# Altium project eHub.PrjPcb
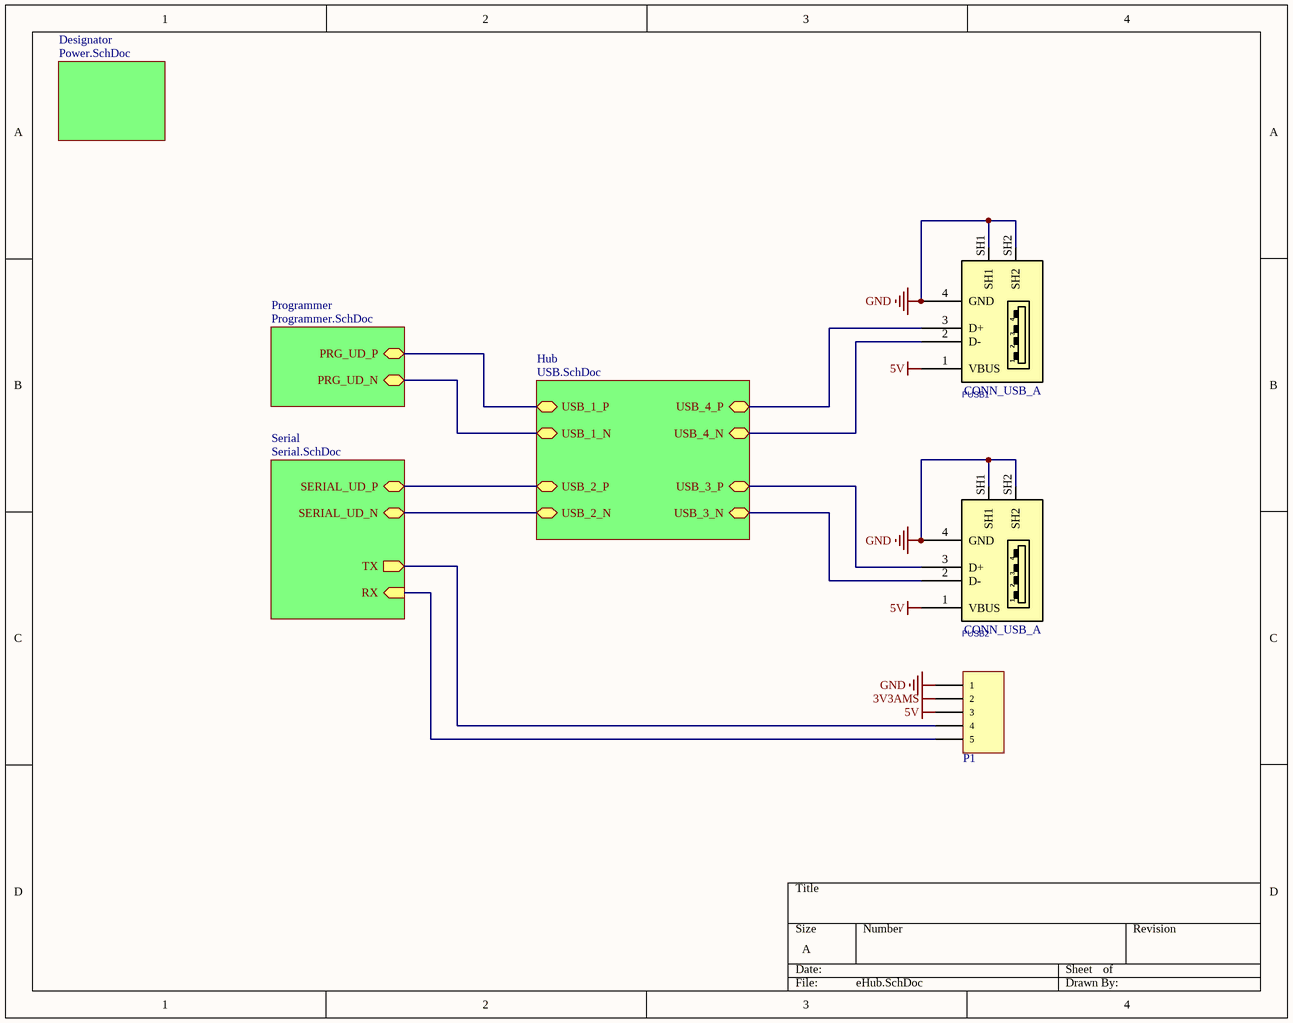
[diagram p0: eHub.SchDoc]
5 sheets, 86 parts. Net scope: hierarchical (ports join the sheet entries above them; power ports are global).
Board file: eHub.PcbDoc
Sheets:
  eHub.SchDoc
    Programmer = Programmer.SchDoc
    Serial = Serial.SchDoc
    Hub = USB.SchDoc
    Designator = Power.SchDoc

## Sheet eHub.SchDoc
size A; SheetNumber: 1; SheetTotal: 5

### Parts
P1  Header, 5-Pin  [HDR1X5]  (value not drawn)
PUSB1  CONN_USB_A  [USB_A_REC_RA_THD]
PUSB2  CONN_USB_A  [USB_A_REC_RA_THD]

### Sub-sheets
Designator = Power.SchDoc: no entries
Hub = USB.SchDoc: USB_4_P (bidir), USB_3_N (bidir), USB_2_P (bidir), USB_1_P (bidir), USB_3_P (bidir), USB_4_N (bidir), USB_2_N (bidir), USB_1_N (bidir)
Programmer = Programmer.SchDoc: PRG_UD_N (bidir), PRG_UD_P (bidir)
Serial = Serial.SchDoc: SERIAL_UD_N (bidir), TX (out), RX (in), SERIAL_UD_P (bidir)

### Nets
3V3AMS: P1.2
5V: P1.3 PUSB1.1(VBUS) PUSB2.1(VBUS)
GND: P1.1 PUSB1.4(GND) PUSB1.SH1 PUSB1.SH2 PUSB2.4(GND) PUSB2.SH1 PUSB2.SH2
PRG_UD_N: sheet Programmer/PRG_UD_N, sheet Hub/USB_1_N
PRG_UD_P: sheet Programmer/PRG_UD_P, sheet Hub/USB_1_P
RX: P1.5 ; sheet Serial/RX
SERIAL_UD_N: sheet Serial/SERIAL_UD_N, sheet Hub/USB_2_N
SERIAL_UD_P: sheet Serial/SERIAL_UD_P, sheet Hub/USB_2_P
TX: P1.4 ; sheet Serial/TX
USB_3_N: PUSB2.2(D-) ; sheet Hub/USB_3_N
USB_3_P: PUSB2.3(D+) ; sheet Hub/USB_3_P
USB_4_N: PUSB1.2(D-) ; sheet Hub/USB_4_N
USB_4_P: PUSB1.3(D+) ; sheet Hub/USB_4_P

### Library data of the parts
P1 = Header 5: LatestRevisionDate: 17-Jul-2002; LatestRevisionNote: Re-released for DXP Platform.; Publisher: Altium Limited
PUSB1 PUSB2 = CONN_USB_A_REC_RA_THD: CONN, USB, A, RECEPTACLE, R/A, THD; VALUE: CONN_USB_A

## Sheet Programmer.SchDoc
size A4; SheetNumber: 4; SheetTotal: 5
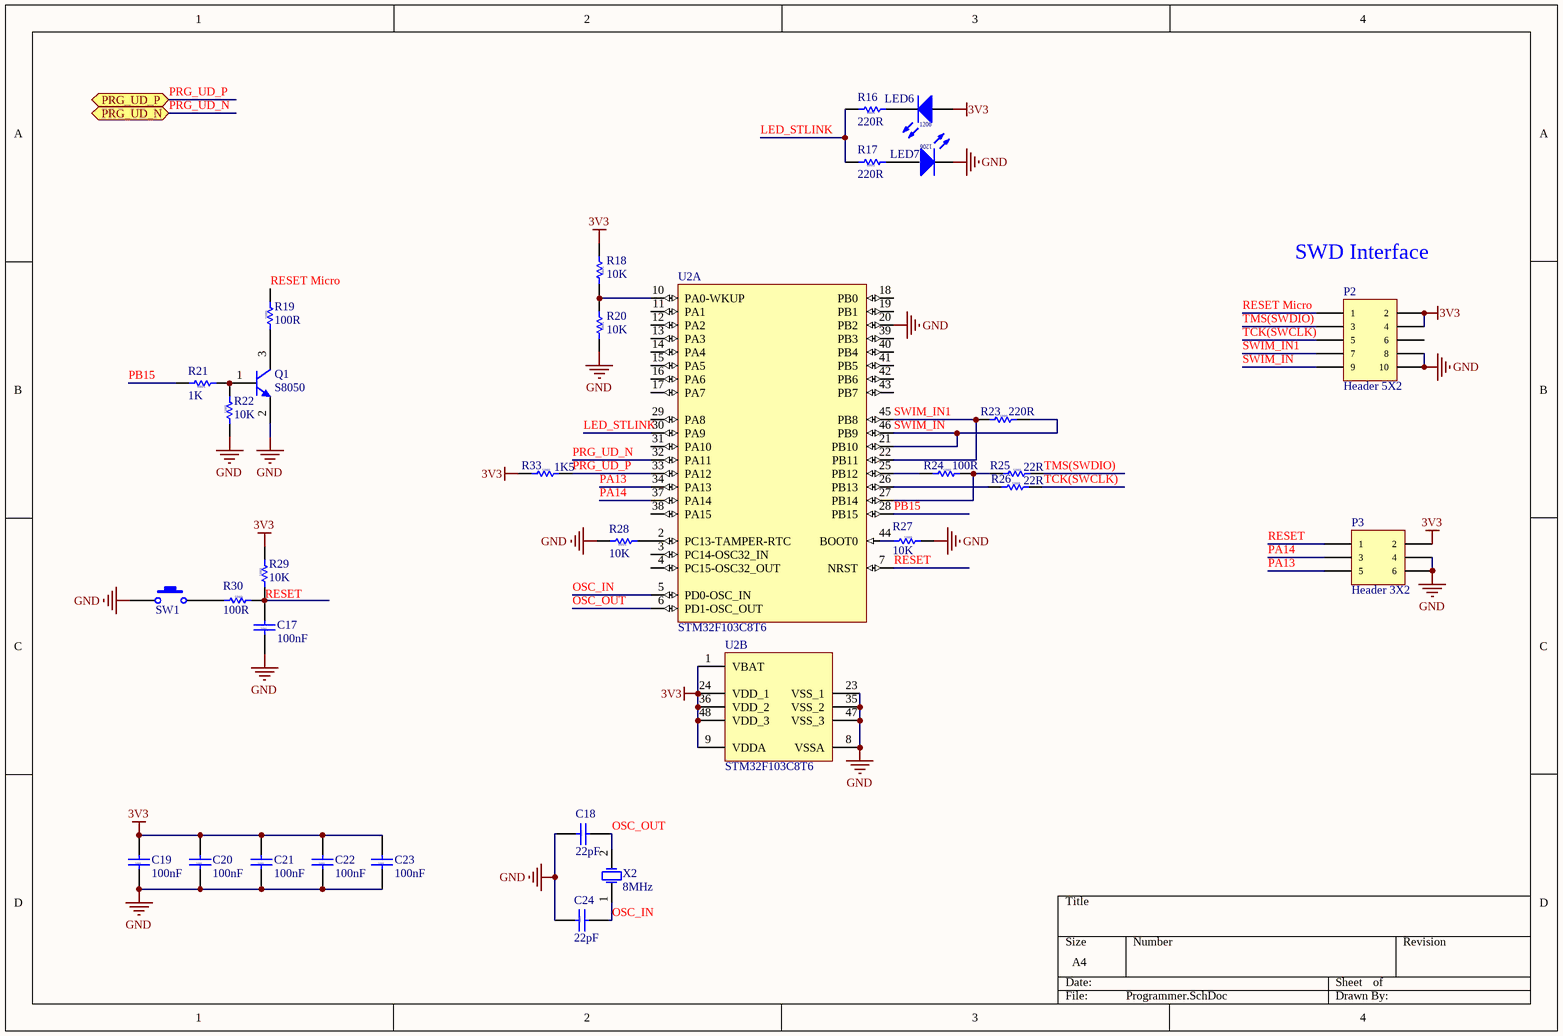
[diagram p1: Programmer.SchDoc]

### Parts
C17  100nF  [RES 0805]
C18  22pF  [RES 0805]
C19  100nF  [RES 0805]
C20  100nF  [RES 0805]
C21  100nF  [RES 0805]
C22  100nF  [RES 0805]
C23  100nF  [RES 0805]
C24  22pF  [RES 0805]
LED6  LED 1206  [LED 1206]  (value not drawn)
LED7  LED 1206  [LED 1206]  (value not drawn)
P2  Header 5X2  [HDR2X5]
P3  Header 3X2  [HDR2X3]
Q1  S8050  [SOT-23]
R16  220R  [RES 0805]
R17  220R  [RES 0805]
R18  10K  [RES 0805]
R19  100R  [RES 0805]
R20  10K  [RES 0805]
R21  1K  [RES 0805]
R22  10K  [RES 0805]
R23  220R  [RES 0805]
R24  100R  [RES 0805]
R25  22R  [RES 0805]
R26  22R  [RES 0805]
R27  10K  [RES 0805]
R28  10K  [RES 0805]
R29  10K  [RES 0805]
R30  100R  [RES 0805]
R33  1K5  [RES 0805]
SW1  Pushing Switch  [micro sch]  (value not drawn)
U2  STM32F103C8T6  [STM-LQFP48_N]  (parts A,B of 2)
X2  8MHz  [XTAL - SMD]

### Ports
PRG_UD_N (bidir), PRG_UD_P (bidir)

### Nets
3V3: C19.2 C20.2 C21.2 C22.2 C23.2 LED6.1(A) P2.2 P2.4 P3.2 R18.1 R29.2 R33.1 U2.1(VBAT) U2.9(VDDA) U2.24(VDD_1) U2.36(VDD_2) U2.48(VDD_3)
GND: C17.1 C18.1 C19.1 C20.1 C21.1 C22.1 C23.1 C24.1 LED7.2(K) P2.8 P2.10 P3.4 P3.6 Q1.2(E) R20.2 R22.1 R27.2 R28.2 SW1.1 U2.8(VSSA) U2.20(PB2) U2.23(VSS_1) U2.35(VSS_2) U2.47(VSS_3)
LED_STLINK: R16.2 R17.2 U2.30(PA9)
OSC_IN: C24.2 U2.5(PD0-OSC_IN) X2.1(OSC1)
OSC_OUT: C18.2 U2.6(PD1-OSC_OUT) X2.2(OSC2)
PA13: P3.5 U2.34(PA13)
PA14: P3.3 U2.37(PA14)
PB15: R21.2 U2.28(PB15)
PRG_UD_N: U2.32(PA11) ; port PRG_UD_N
PRG_UD_P: R33.2 U2.33(PA12) ; port PRG_UD_P
RESET: C17.2 P3.1 R29.1 R30.2 U2.7(NRST)
RESET Micro: P2.1 R19.2
SWIM_IN: P2.9 R23.2 U2.21(PB10) U2.46(PB9)
SWIM_IN1: P2.7 R23.1 U2.22(PB11) U2.45(PB8)
TCK(SWCLK): P2.5 R26.2
TMS(SWDIO): P2.3 R25.2
NetLED6_2: LED6.2(K) R16.1
NetLED7_1: LED7.1(A) R17.1
NetQ1_1: Q1.1(B) R21.1 R22.2
NetQ1_3: Q1.3(C) R19.1
NetR18_2: R18.2 R20.1 U2.10(PA0-WKUP)
NetR24_1: R24.1 U2.25(PB12)
NetR24_2: R24.2 R25.1 U2.27(PB14)
NetR26_1: R26.1 U2.26(PB13)
NetR27_1: R27.1 U2.44(BOOT0)
NetR28_1: R28.1 U2.2(PC13-TAMPER-RTC)
NetR30_1: R30.1 SW1.2

Not connected (* = marked no-connect by the designer): P2 6; U2 3(PC14-OSC32_IN) 4(PC15-OSC32_OUT) 11(PA1) 12(PA2) 13(PA3) 14(PA4) 15(PA5) 16(PA6) 17(PA7) 18(PB0) 19(PB1) 29(PA8) 31(PA10) 38(PA15) 39(PB3) 40(PB4) 41(PB5) 42(PB6) 43(PB7)

### Notes on the sheet
- (near P2) SWD Interface
- (in symbol CAP 0805) 0805
- (in symbol LED 1206) 1206
- (in symbol RES 0805) 0805

### Library data of the parts
C17-C24 = CAP 0805
P2 = Header 5X2: Header, 5-Pin, Dual row; LatestRevisionDate: 17-Jul-2002; LatestRevisionNote: Re-released for DXP Platform.; Publisher: Altium Limited
P3 = Header 3X2: Header, 3-Pin, Dual row; LatestRevisionDate: 17-Jul-2002; LatestRevisionNote: Re-released for DXP Platform.; Publisher: Altium Limited
Q1 = S8050 SMD
R16-R30 R33 = RES 0805
SW1 = Pushing Switch 2Pin: Published: 24-Mar-1999; LatestRevisionDate: 17-Jul-2002; LatestRevisionNote: Re-released for DXP Platform.; PackageReference: SPST-2; Publisher: Altium Limited
U2 = STM32F103C8T6: ARM Cortex-M3 32-bit MCU, 64 KB Flash, 20 KB Internal RAM, 37 I/Os, 48-pin LQFP, -40 to 85 degC, Tray; A/D Converter: 2x12-bit (10 Channel); FLASH Size (Prog) (kB): 64; I/Os (High Current): 37; Internal RAM Size (kB): 20; Operating Frequency(F) (Processor speed) (MHz): 72; Supply Voltage(Vcc) min (V): 2; DatasheetVersion: Rev. 16; PackageVersion: Rev. 6, 06/2013; PackageReference: LQFP48; PackageDescription: 48-Pin Low Profile Quad Flat Package, 7 x 7 mm Body, 0.5 mm Pitch; Supplier 1: Digi-Key; Supplier Part Number 1: 497-6063-ND; Supplier 2: Farnell; Supplier Part Number 2: 1447637; Supplier 3: Newark; Supplier Part Number 3: 59M2182; Supplier 4: Newark; Supplier Part Number 4: 57P1222; Supplier 5: Mouser; Supplier Part Number 5: 511-STM32F103C8T6; Core: ARM Cortex-M3; Packing: Tray; Mounting Technology: Surface Mount; PartNumber: STM32F103C8T6; ComponentLink1Description: Manufacturer URL; ComponentLink1URL: http://www.st.com/web/en/home.html; ComponentLink2Description: Datasheet; ComponentLink2URL: http://www.st.com/st-web-ui/static/active/en/resource/technical/document/datasheet/CD00161566.pdf; ComponentLink3Description: Package Specification; ComponentLink3URL: http://www.st.com/st-web-ui/static/active/en/resource/technical/document/datasheet/DM00058181.pdf
X2 = XTAL - SMD

## Sheet Serial.SchDoc
size A; SheetNumber: 4; SheetTotal: 5
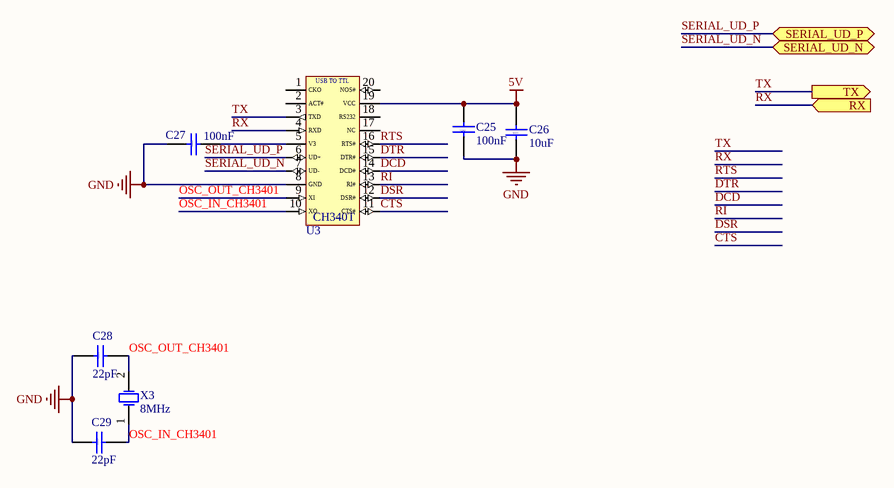
[diagram p2: Serial.SchDoc]

### Parts
C25  100nF  [RES 0805]
C26  10uF  [Res 1206]
C27  100nF  [RES 0805]
C28  22pF  [RES 0805]
C29  22pF  [RES 0805]
U3  CH340  [SSOP20]  (value not drawn)
X3  8MHz  [XTAL - SMD]

### Ports
RX (in), SERIAL_UD_N (bidir), SERIAL_UD_P (bidir), TX (out)

### Nets
5V: C25.2 C26.2 U3.19(VCC)
GND: C25.1 C26.1 C27.1 C28.1 C29.1 U3.8(GND)
CTS: U3.11(CTS#)
DCD: U3.14(DCD#)
DSR: U3.12(DSR#)
DTR: U3.15(DTR#)
OSC_IN_CH3401: C29.2 U3.10(XO) X3.1(OSC1)
OSC_OUT_CH3401: C28.2 U3.9(XI) X3.2(OSC2)
RI: U3.13(RI#)
RTS: U3.16(RTS#)
RX: U3.4(RXD) ; port RX
SERIAL_UD_N: U3.7(UD-) ; port SERIAL_UD_N
SERIAL_UD_P: U3.6(UD+) ; port SERIAL_UD_P
TX: U3.3(TXD) ; port TX
NetC27_2: C27.2 U3.5(V3)

Not connected (* = marked no-connect by the designer): U3 1(CKO) 2(ACT#) 17(NC) 18(RS232) 20(NOS#)

### Notes on the sheet
- (in symbol CAP 0805) 0805
- (in symbol CAP 1206) 1206
- (in symbol CH340T) USB TO TTL

### Library data of the parts
C25 C27-C29 = CAP 0805
C26 = CAP 1206
U3 = CH340T: USB to serial chip CH340
X3 = XTAL - SMD

## Sheet USB.SchDoc
size A; SheetNumber: 3; SheetTotal: 5
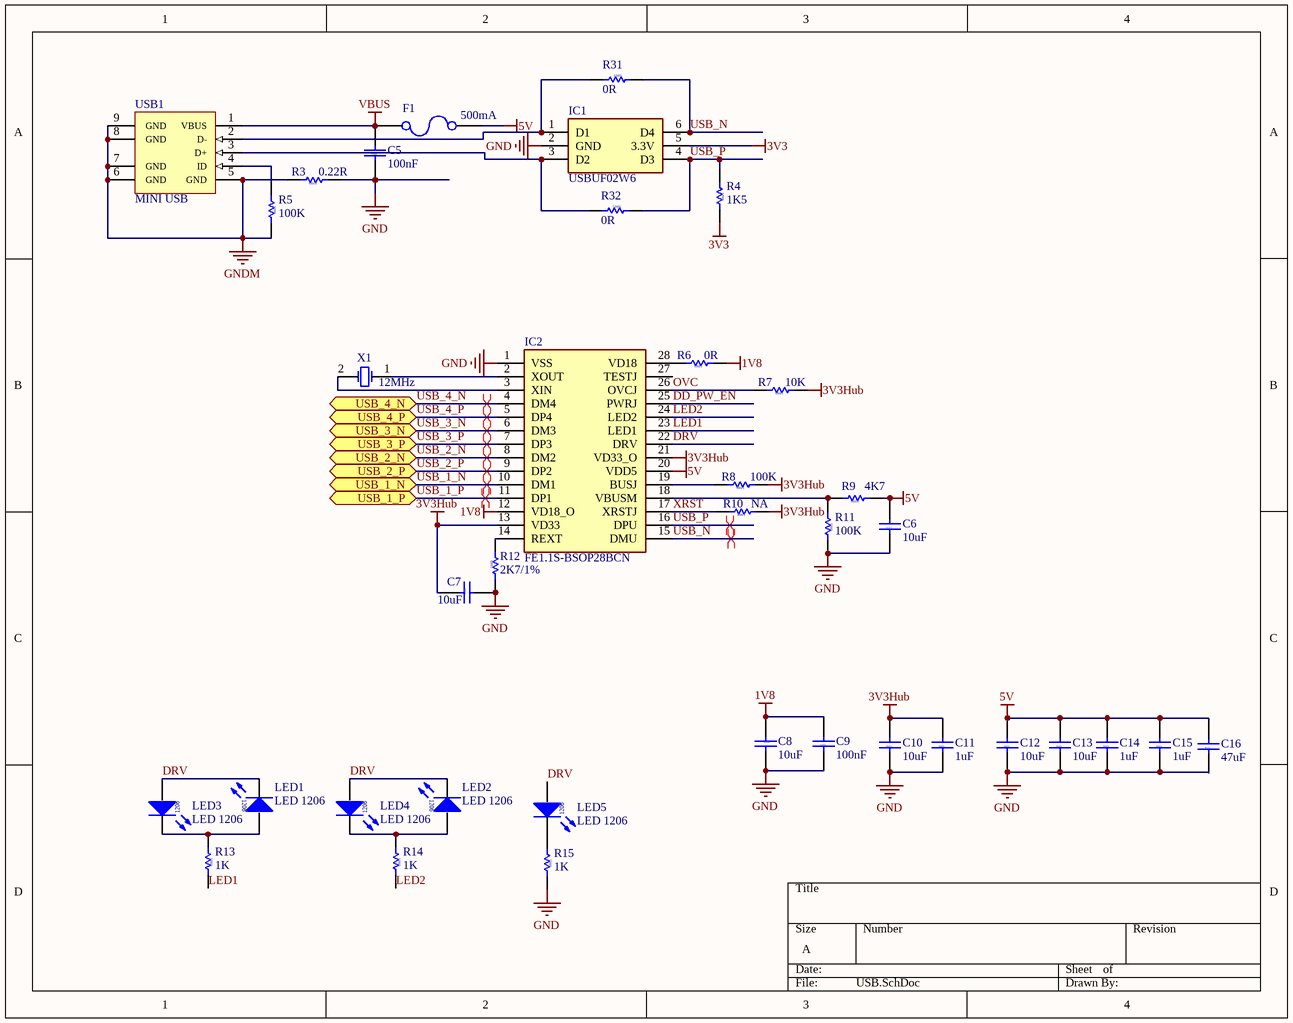
[diagram p3: USB.SchDoc]

### Parts
C5  100nF  [RES 0805]
C6  10uF  [Res 1206]
C7  10uF  [Res 1206]
C8  10uF  [Res 1206]
C9  100nF  [RES 0805]
C10  10uF  [Res 1206]
C11  1uF  [Res 1206]
C12  10uF  [Res 1206]
C13  10uF  [Res 1206]
C14  1uF  [Res 1206]
C15  1uF  [Res 1206]
C16  47uF  [Res 1206]
F1  500mA  [Res 1206]
IC1  USBUF02W6  [SOT65P210X110-6N]
IC2  FE1.1S-BSOP28BCN  [SOP64P600X175-28N]
LED1  LED 1206  [LED 1206]
LED2  LED 1206  [LED 1206]
LED3  LED 1206  [LED 1206]
LED4  LED 1206  [LED 1206]
LED5  LED 1206  [LED 1206]
R3  0.22R  [RES 0805]
R4  1K5  [RES 0805]
R5  100K  [RES 0805]
R6  0R  [RES 0805]
R7  10K  [RES 0805]
R8  100K  [RES 0805]
R9  4K7  [RES 0805]
R10  NA  [RES 0805]
R11  100K  [RES 0805]
R12  2K7/1%  [RES 0805]
R13  1K  [RES 0805]
R14  1K  [RES 0805]
R15  1K  [RES 0805]
R31  0R  [RES 0805]
R32  0R  [RES 0805]
USB1  MINI USB  [USB MINI DIP]
X1  12MHz  [XTAL - SMD]

### Ports
USB_1_N (bidir), USB_1_P (bidir), USB_2_N (bidir), USB_2_P (bidir), USB_3_N (bidir), USB_3_P (bidir), USB_4_N (bidir), USB_4_P (bidir)

### Nets
1V8: C8.1 C9.2 IC2.12(VD18_O) R6.1
3V3: IC1.5(3.3V) R4.2
3V3Hub: C7.1 C10.2 C11.2 IC2.13(VD33) IC2.21(VD33_O) R7.1 R8.1 R10.1
5V: C6.2 C12.2 C13.2 C14.2 C15.2 C16.2 F1.2 IC2.20(VDD5) R9.1
GND: C5.1 C6.1 C7.2 C8.2 C9.1 C10.1 C11.1 C12.1 C13.1 C14.1 C15.1 C16.1 IC1.2(GND) IC2.1(VSS) R3.1 R11.2 R12.1 R15.2
GNDM: R3.2 R5.2 USB1.5(GND) USB1.6(GND) USB1.7(GND) USB1.8(GND) USB1.9(GND)
VBUS: C5.2 F1.1 USB1.1(VBUS)
DD_PW_EN: IC2.25(PWRJ)
DRV: IC2.22(DRV) LED1.2(K) LED2.2(K) LED3.1(A) LED4.1(A) LED5.1(A)
LED1: IC2.23(LED1) R13.2
LED2: IC2.24(LED2) R14.2
OVC: IC2.26(OVCJ) R7.2
USB_1_N: IC2.10(DM1) ; port USB_1_N  [project net PRG_UD_N]
USB_1_P: IC2.11(DP1) ; port USB_1_P  [project net PRG_UD_P]
USB_2_N: IC2.8(DM2) ; port USB_2_N  [project net SERIAL_UD_N]
USB_2_P: IC2.9(DP2) ; port USB_2_P  [project net SERIAL_UD_P]
USB_3_N: IC2.6(DM3) ; port USB_3_N
USB_3_P: IC2.7(DP3) ; port USB_3_P
USB_4_N: IC2.4(DM4) ; port USB_4_N
USB_4_P: IC2.5(DP4) ; port USB_4_P
USB_N: IC1.6(D4) IC2.15(DMU) R31.2
USB_P: IC1.4(D3) IC2.16(DPU) R4.1 R32.2
XRST: IC2.17(XRSTJ) R10.2
NetIC1_1: IC1.1(D1) R31.1 USB1.2(D-)
NetIC1_3: IC1.3(D2) R32.1 USB1.3(D+)
NetIC2_2: IC2.2(XOUT) X1.1(OSC1)
NetIC2_3: IC2.3(XIN) X1.2(OSC2)
NetIC2_14: IC2.14(REXT) R12.2
NetIC2_18: IC2.18(VBUSM) R9.2 R11.1
NetIC2_19: IC2.19(BUSJ) R8.2
NetIC2_28: IC2.28(VD18) R6.2
NetLED1_1: LED1.1(A) LED3.2(K) R13.1
NetLED2_1: LED2.1(A) LED4.2(K) R14.1
NetLED5_2: LED5.2(K) R15.1
NetR5_1: R5.1 USB1.4(ID)

Not connected (* = marked no-connect by the designer): IC2 27(TESTJ)

### Layout directives
differential pair: PRG_UD_N, PRG_UD_P, SERIAL_UD_N, SERIAL_UD_P, USB_3_N, USB_3_P, USB_4_N, USB_4_P, USB_N, USB_P

### Notes on the sheet
- (in symbol CAP 0805) 0805
- (in symbol CAP 1206) 1206
- (in symbol LED 1206) 1206
- (in symbol RES 0805) 0805

### Library data of the parts
C5 C9 = CAP 0805
C6-C8 C10-C16 = CAP 1206
F1 = FUSE 1206
IC1 = USBUF02W6: Integrated Circuit; Manufacturer_Name: STMicroelectronics; Datasheet Link: http://www.st.com/web/en/resource/technical/document/datasheet/CD00002046.pdf; Height: 1.1mm; Manufacturer_Part_Number: USBUF02W6; Mouser Part Number: 511-USBUF02W6; Mouser Price/Stock: https://www.mouser.co.uk/ProductDetail/STMicroelectronics/USBUF02W6?qs=po45yt2pPpsSshudxXreiQ%3D%3D; Arrow Part Number: USBUF02W6; Arrow Price/Stock: https://www.arrow.com/en/products/usbuf02w6/stmicroelectronics?region=nac
IC2 = FE1.1S-BSOP28BCN: Integrated Circuit; Manufacturer_Name: Terminus Technology; Datasheet Link: https://datasheet.lcsc.com/lcsc/1811021220_Terminus-Tech-FE1-1S-BSOP28BCN_C9359.pdf; Height: 1.75mm; Manufacturer_Part_Number: FE1.1S-BSOP28BCN
R3-R9 R11-R15 R31 R32 = RES 0805
R10 = RES 0805: 100K
USB1 = USB MINI DIP
X1 = XTAL - SMD

## Sheet Power.SchDoc
size A; SheetNumber: 5; SheetTotal: 5
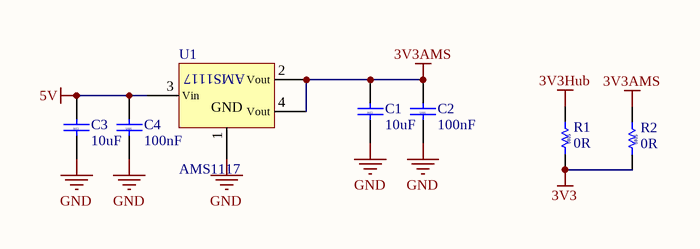
[diagram p4: Power.SchDoc]

### Parts
C1  10uF  [Res 1206]
C2  100nF  [RES 0805]
C3  10uF  [Res 1206]
C4  100nF  [RES 0805]
R1  0R  [RES 0805]
R2  0R  [RES 0805]
U1  AMS1117  [SOT-223]

### Nets
3V3: R1.2 R2.2
3V3AMS: C1.2 C2.2 R2.1 U1.2(Vout) U1.4(Vout)
3V3Hub: R1.1
5V: C3.2 C4.2 U1.3(Vin)
GND: C1.1 C2.1 C3.1 C4.1 U1.1(GND)

### Notes on the sheet
- (in symbol CAP 0805) 0805
- (in symbol CAP 1206) 1206
- (in symbol RES 0805) 0805

### Library data of the parts
C1 C3 = CAP 1206
C2 C4 = CAP 0805
R1 R2 = RES 0805
U1 = AMS1117: Regulators

## Nets that join several sheets
3V3: Programmer (17 pins), USB (IC1.5 R4.2), Power (R1.2 R2.2)
3V3AMS: eHub (P1.2), Power (5 pins)
3V3Hub: USB (8 pins), Power (R1.1)
5V: eHub (P1.3 PUSB1.1 PUSB2.1), Serial (C25.2 C26.2 U3.19), USB (9 pins), Power (C3.2 C4.2 U1.3)
GND: eHub (7 pins), Programmer (24 pins), Serial (6 pins), USB (18 pins), Power (5 pins)
PRG_UD_N: Programmer (U2.32), USB (IC2.10)
PRG_UD_P: Programmer (R33.2 U2.33), USB (IC2.11)
RX: eHub (P1.5), Serial (U3.4)
SERIAL_UD_N: Serial (U3.7), USB (IC2.8)
SERIAL_UD_P: Serial (U3.6), USB (IC2.9)
TX: eHub (P1.4), Serial (U3.3)
USB_3_N: eHub (PUSB2.2), USB (IC2.6)
USB_3_P: eHub (PUSB2.3), USB (IC2.7)
USB_4_N: eHub (PUSB1.2), USB (IC2.4)
USB_4_P: eHub (PUSB1.3), USB (IC2.5)